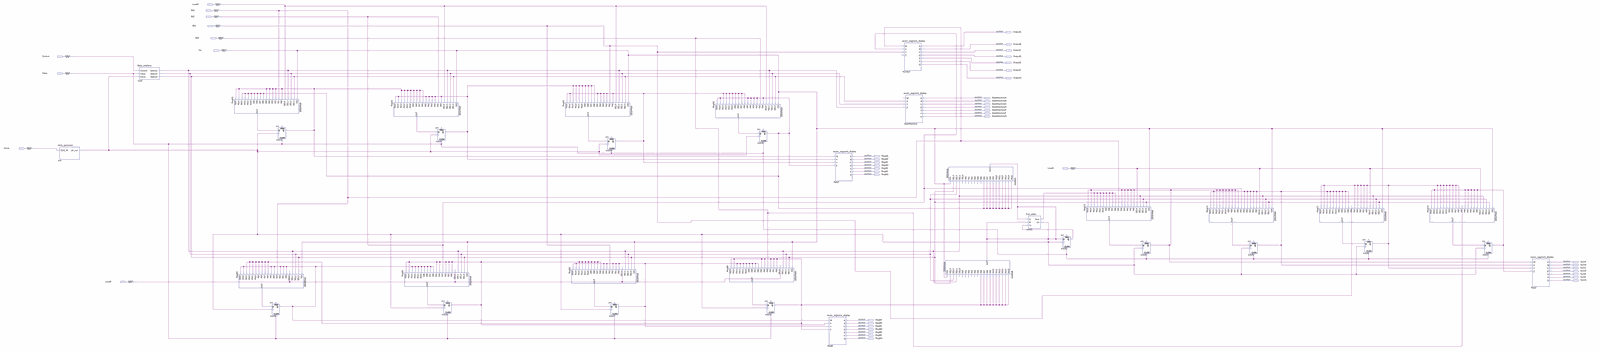
[diagram p0: schematic sheet, whole]
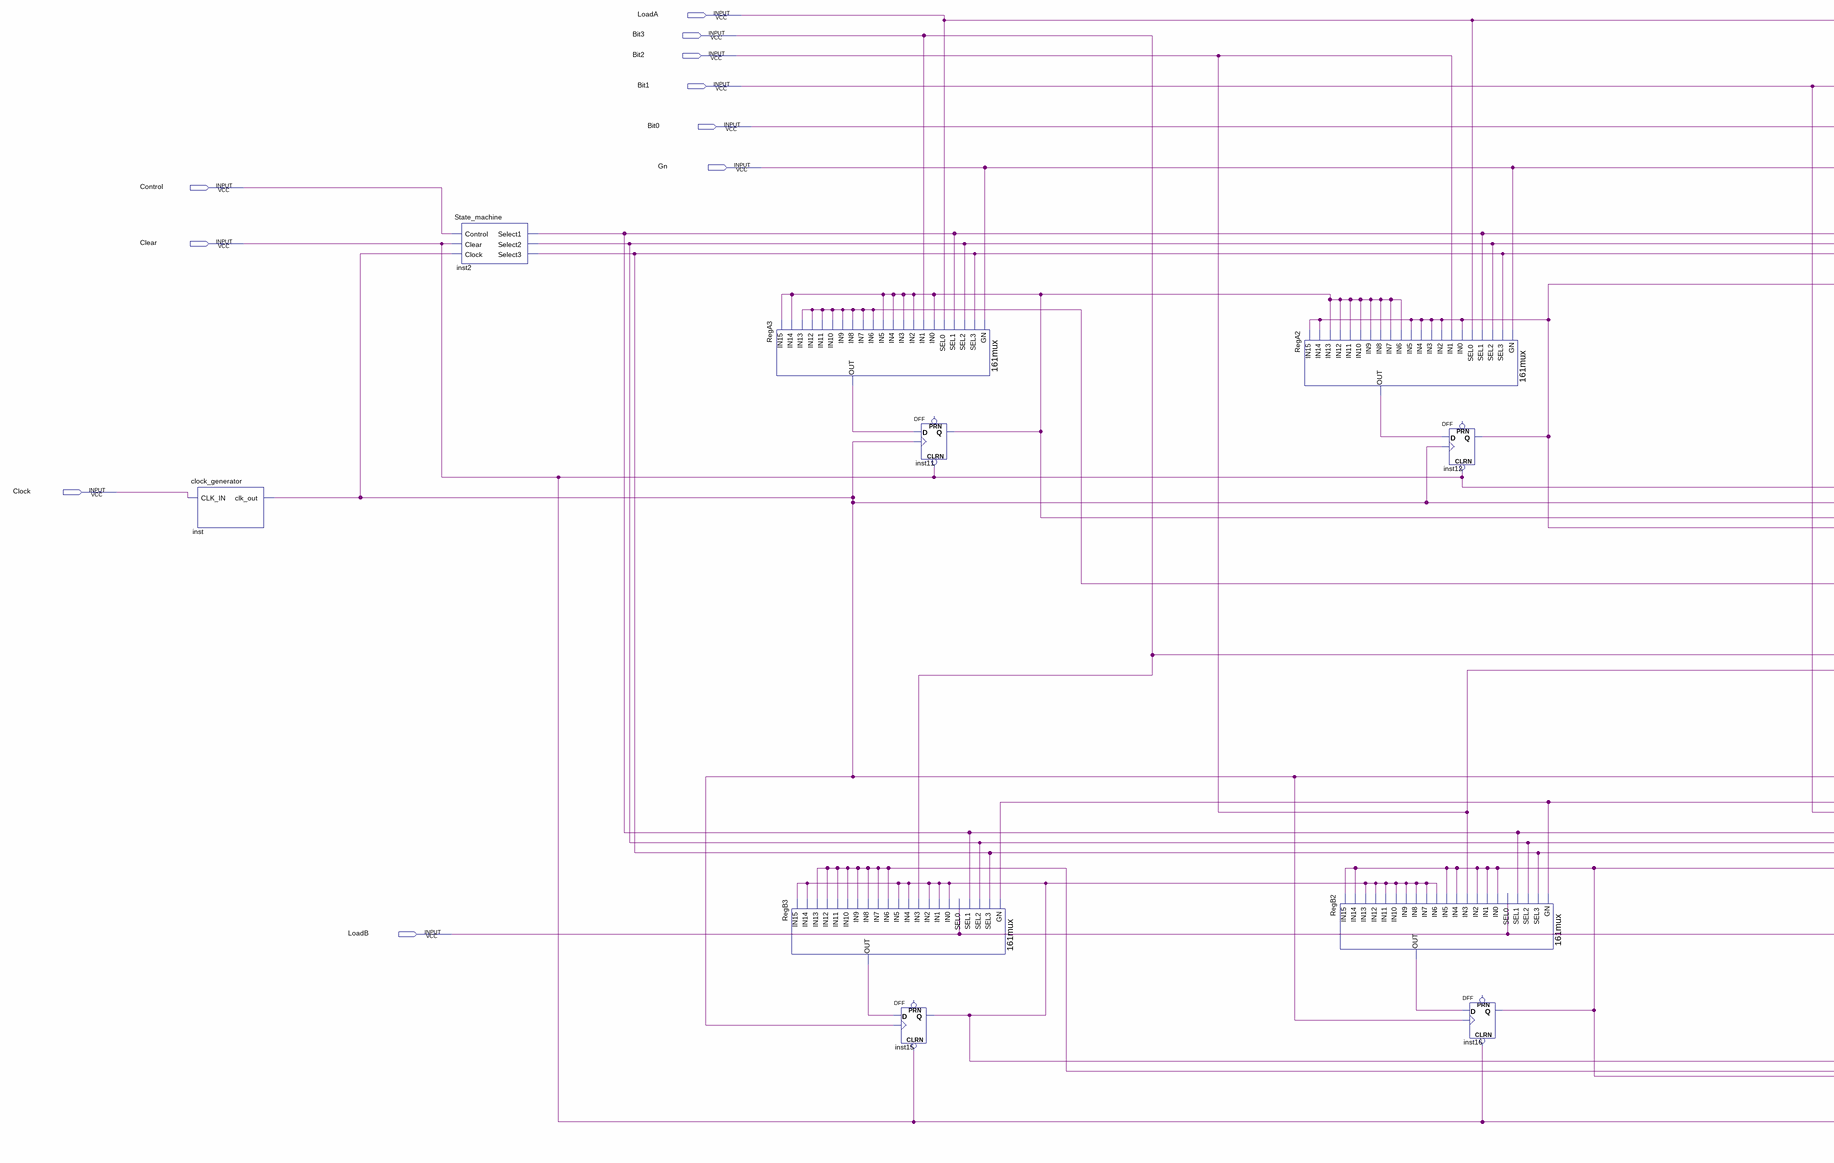
[diagram p1: schematic sheet, left part]
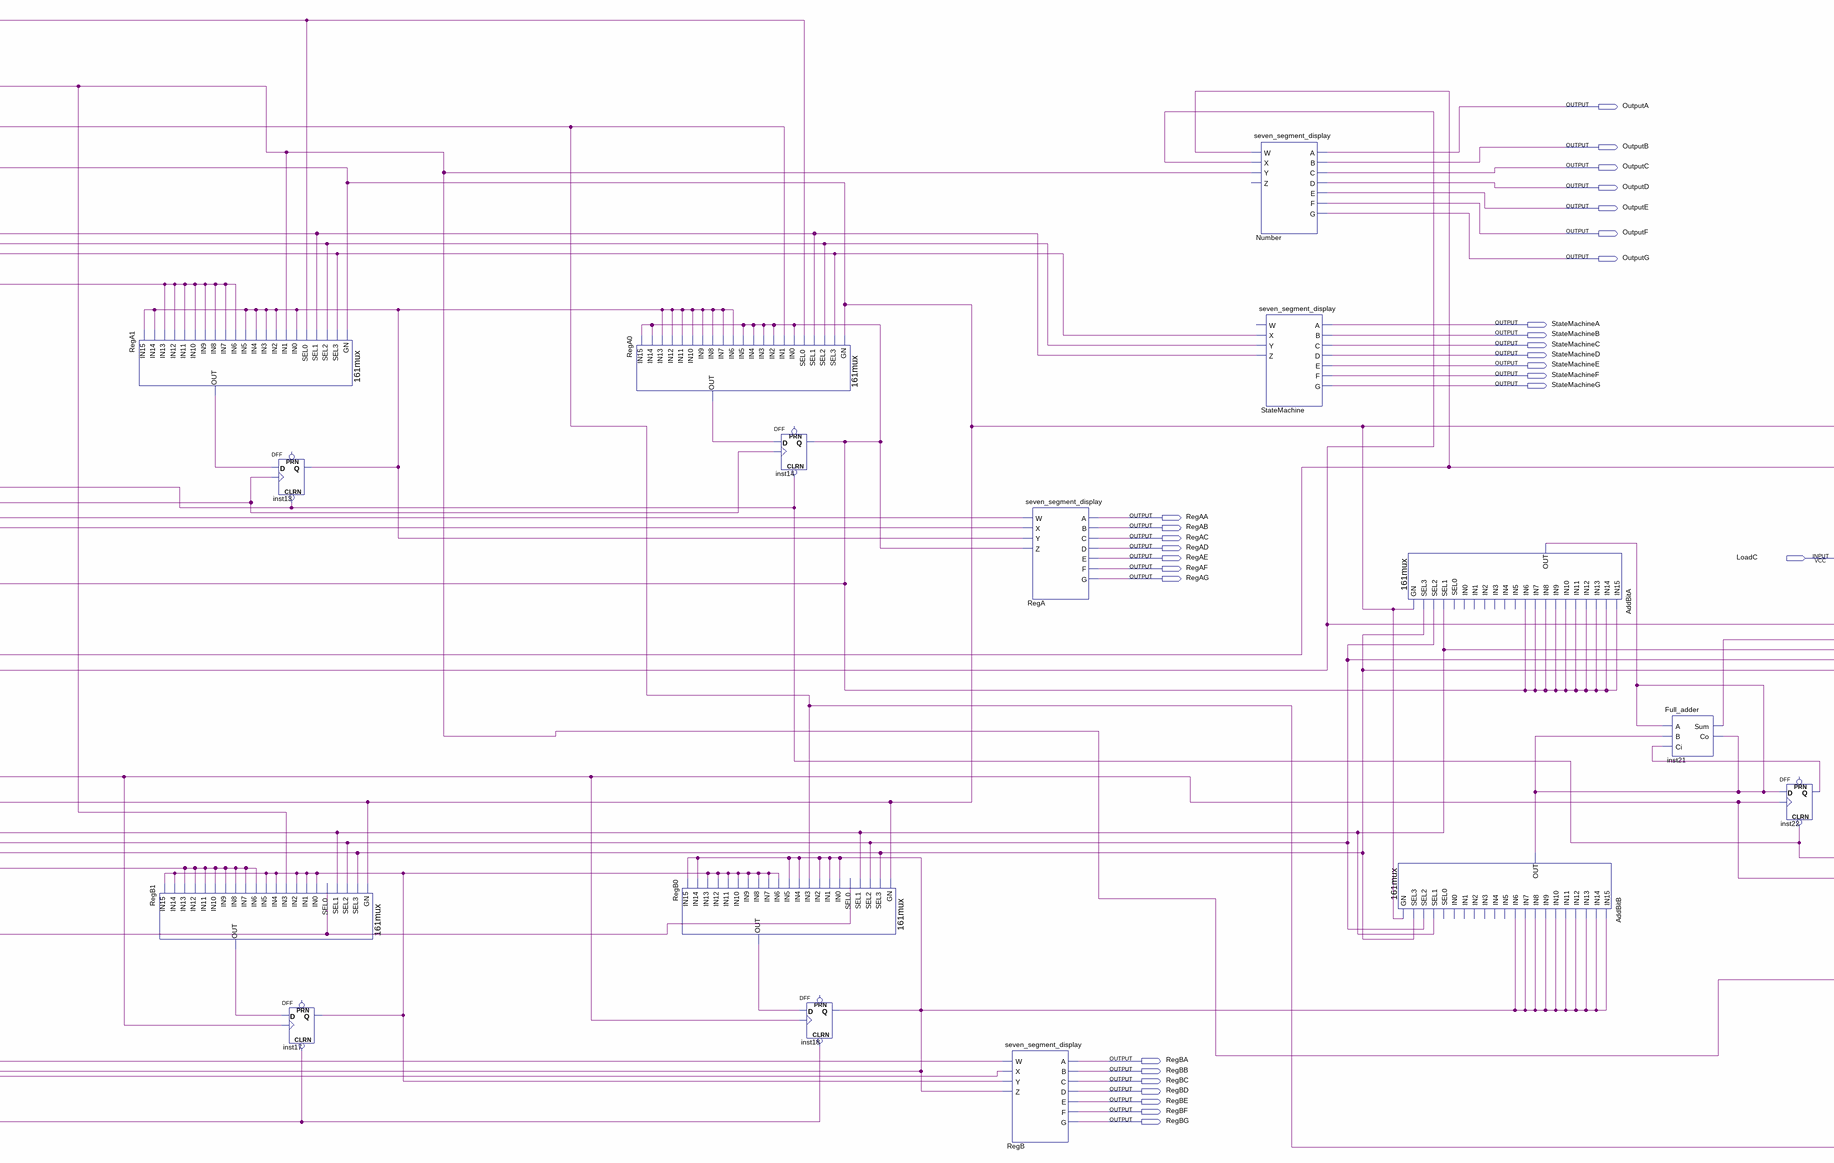
[diagram p2: schematic sheet, centre part]
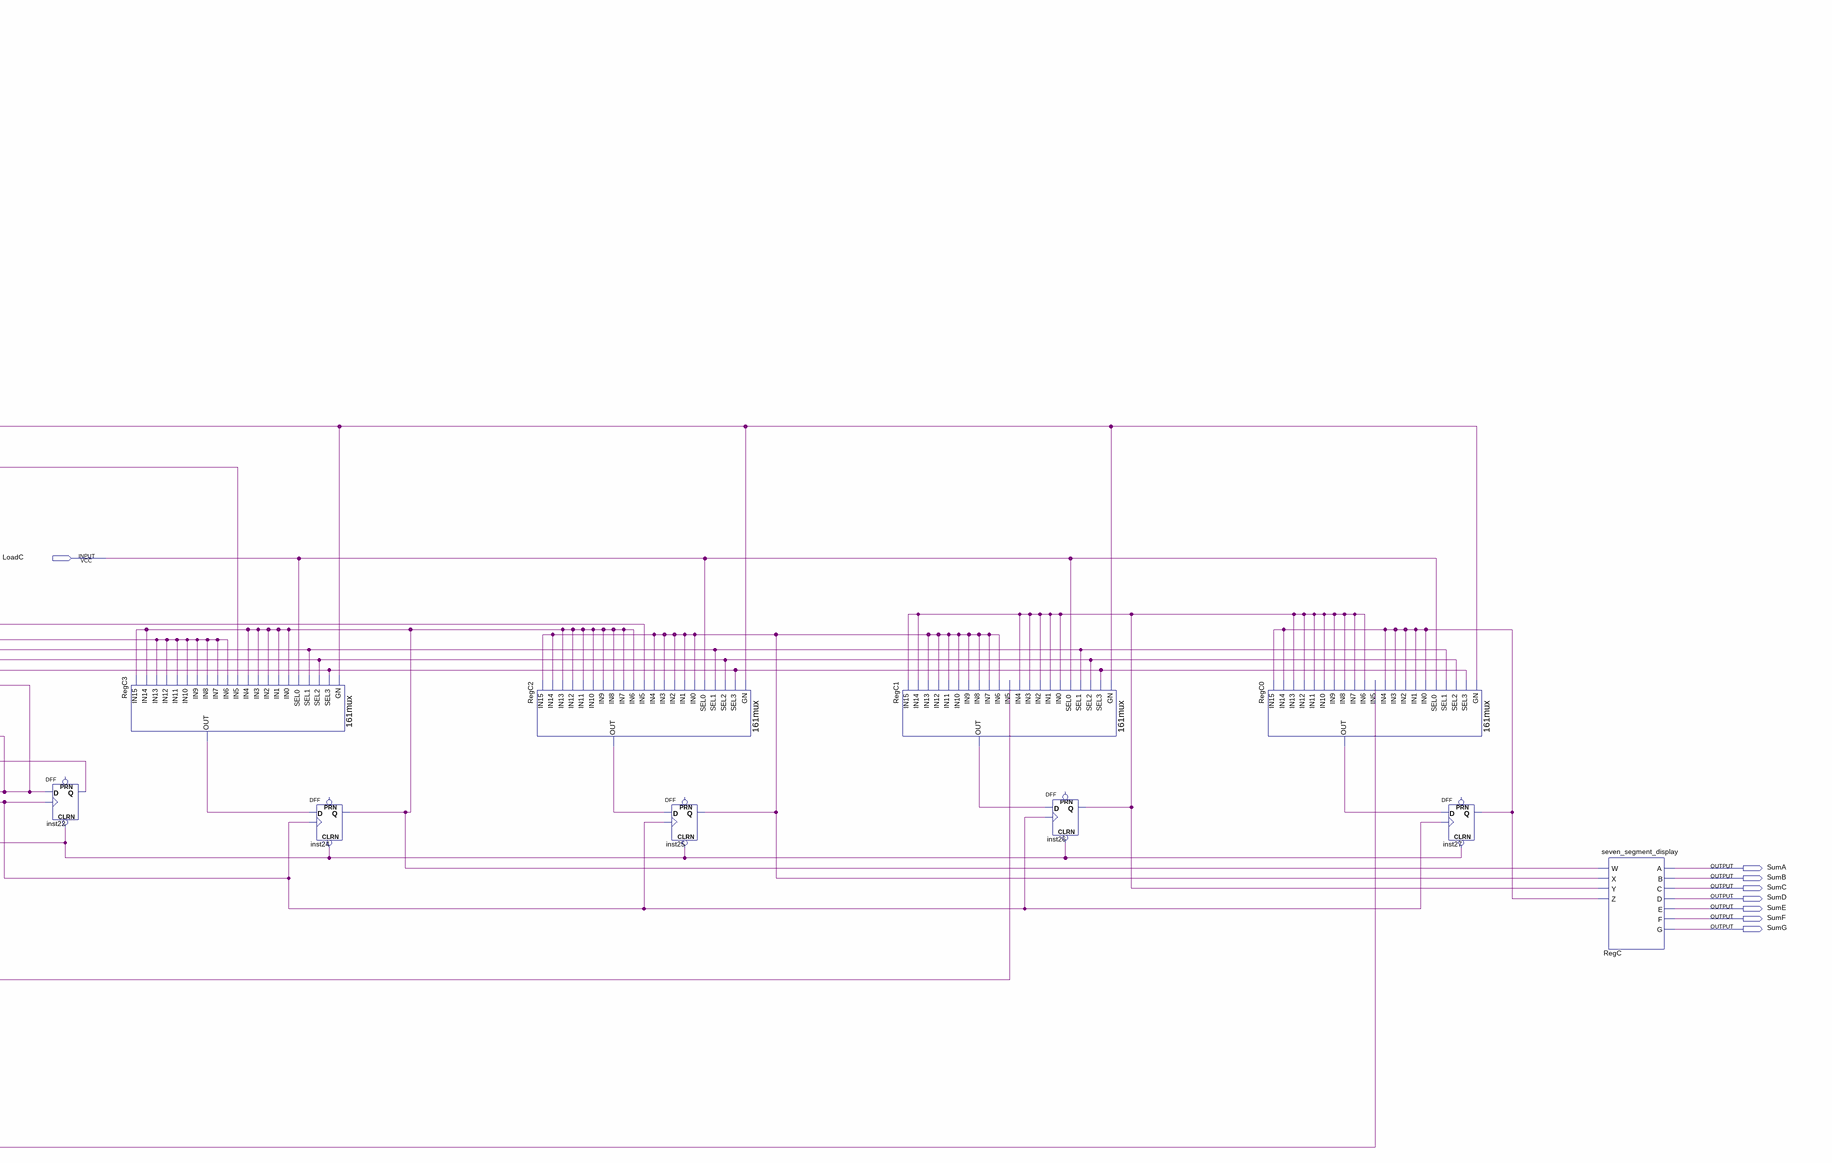
[diagram p3: schematic sheet, right part]
// Quartus schematic 4BitAdder.bdf as structural Verilog: 35 symbols, 46 pins
module \4BitAdder  (
  input  LoadA,
  input  Bit3,
  input  Bit2,
  input  Bit1,
  input  Bit0,
  input  Gn,
  input  Control,
  input  Clear,
  input  Clock,
  input  LoadC,
  input  LoadB,
  output OutputA,
  output OutputB,
  output OutputC,
  output OutputD,
  output OutputE,
  output OutputF,
  output OutputG,
  output StateMachineA,
  output StateMachineB,
  output StateMachineC,
  output StateMachineD,
  output StateMachineE,
  output StateMachineF,
  output StateMachineG,
  output RegAA,
  output RegAB,
  output RegAC,
  output RegAD,
  output RegAE,
  output RegAF,
  output RegAG,
  output SumA,
  output SumB,
  output SumC,
  output SumD,
  output SumE,
  output SumF,
  output SumG,
  output RegBA,
  output RegBB,
  output RegBC,
  output RegBD,
  output RegBE,
  output RegBF,
  output RegBG
);

  wire AddBitA_out, inst2_select1, inst2_select2, inst2_select3, inst11_q, inst12_q, inst13_q, inst14_q,
       inst15_q, inst16_q, inst17_q, inst18_q, inst21_sum, inst22_q, inst24_q, inst25_q, inst26_q, inst27_q,
       inst_clk_out, RegA0_out, RegA1_out, RegA2_out, RegA3_out, RegB0_out, RegB1_out, RegB2_out, RegB3_out,
       RegC0_out, RegC1_out, RegC2_out, RegC3_out;

  clock_generator inst (.CLK_IN(Clock), .clk_out(inst_clk_out));
  State_machine inst2 (
    .Control(Control), .Clear(Clear), .Clock(inst_clk_out), .Select1(inst2_select1), .Select2(inst2_select2),
    .Select3(inst2_select3));
  \161mux  RegA3 (
    .SEL3(inst2_select3), .GN(Gn), .IN0(inst11_q), .SEL0(LoadA), .SEL1(inst2_select1), .SEL2(inst2_select2),
    .IN3(inst11_q), .IN2(inst11_q), .IN1(Bit3), .IN6(inst14_q), .IN5(inst11_q), .IN4(inst11_q),
    .IN9(inst14_q), .IN8(inst14_q), .IN7(inst14_q), .IN11(inst14_q), .IN12(inst14_q), .IN10(inst14_q),
    .IN15(inst11_q), .IN14(inst11_q), .IN13(inst14_q), .OUT(RegA3_out));
  \161mux  RegB3 (
    .SEL3(inst2_select3), .GN(Gn), .IN0(inst15_q), .SEL0(LoadB), .SEL1(inst2_select1), .SEL2(inst2_select2),
    .IN3(Bit3), .IN2(inst15_q), .IN1(inst15_q), .IN6(inst18_q), .IN5(inst15_q), .IN4(inst15_q),
    .IN9(inst18_q), .IN8(inst18_q), .IN7(inst18_q), .IN11(inst18_q), .IN12(inst18_q), .IN10(inst18_q),
    .IN15(inst15_q), .IN14(inst15_q), .IN13(inst18_q), .OUT(RegB3_out));
  DFF inst15 (.CLRN(Clear), .CLK(inst_clk_out), .D(RegB3_out), .Q(inst15_q));  // open: PRN
  DFF inst11 (.CLRN(Clear), .CLK(inst_clk_out), .D(RegA3_out), .Q(inst11_q));  // open: PRN
  \161mux  RegA2 (
    .SEL3(inst2_select3), .GN(Gn), .IN0(inst12_q), .SEL0(LoadA), .SEL1(inst2_select1), .SEL2(inst2_select2),
    .IN3(inst12_q), .IN2(inst12_q), .IN1(Bit2), .IN6(inst11_q), .IN5(inst12_q), .IN4(inst12_q),
    .IN9(inst11_q), .IN8(inst11_q), .IN7(inst11_q), .IN11(inst11_q), .IN12(inst11_q), .IN10(inst11_q),
    .IN15(inst12_q), .IN14(inst12_q), .IN13(inst11_q), .OUT(RegA2_out));
  \161mux  RegB2 (
    .SEL3(inst2_select3), .GN(Gn), .IN0(inst16_q), .SEL0(LoadB), .SEL1(inst2_select1), .SEL2(inst2_select2),
    .IN3(Bit2), .IN2(inst16_q), .IN1(inst16_q), .IN6(inst15_q), .IN5(inst16_q), .IN4(inst16_q),
    .IN9(inst15_q), .IN8(inst15_q), .IN7(inst15_q), .IN11(inst15_q), .IN12(inst15_q), .IN10(inst15_q),
    .IN15(inst16_q), .IN14(inst16_q), .IN13(inst15_q), .OUT(RegB2_out));
  DFF inst12 (.CLRN(Clear), .CLK(inst_clk_out), .D(RegA2_out), .Q(inst12_q));  // open: PRN
  DFF inst16 (.CLRN(Clear), .CLK(inst_clk_out), .D(RegB2_out), .Q(inst16_q));  // open: PRN
  \161mux  RegA1 (
    .SEL3(inst2_select3), .GN(Gn), .IN0(inst13_q), .SEL0(LoadA), .SEL1(inst2_select1), .SEL2(inst2_select2),
    .IN3(inst13_q), .IN2(inst13_q), .IN1(Bit1), .IN6(inst12_q), .IN5(inst13_q), .IN4(inst13_q),
    .IN9(inst12_q), .IN8(inst12_q), .IN7(inst12_q), .IN11(inst12_q), .IN12(inst12_q), .IN10(inst12_q),
    .IN15(inst13_q), .IN14(inst13_q), .IN13(inst12_q), .OUT(RegA1_out));
  \161mux  RegB1 (
    .SEL3(inst2_select3), .GN(Gn), .IN0(inst17_q), .SEL0(LoadB), .SEL1(inst2_select1), .SEL2(inst2_select2),
    .IN3(Bit1), .IN2(inst17_q), .IN1(inst17_q), .IN6(inst16_q), .IN5(inst17_q), .IN4(inst17_q),
    .IN9(inst16_q), .IN8(inst16_q), .IN7(inst16_q), .IN11(inst16_q), .IN12(inst16_q), .IN10(inst16_q),
    .IN15(inst17_q), .IN14(inst17_q), .IN13(inst16_q), .OUT(RegB1_out));
  DFF inst13 (.CLRN(Clear), .CLK(inst_clk_out), .D(RegA1_out), .Q(inst13_q));  // open: PRN
  DFF inst17 (.CLRN(Clear), .CLK(inst_clk_out), .D(RegB1_out), .Q(inst17_q));  // open: PRN
  \161mux  RegA0 (
    .SEL3(inst2_select3), .GN(Gn), .IN0(inst14_q), .SEL0(LoadA), .SEL1(inst2_select1), .SEL2(inst2_select2),
    .IN3(inst14_q), .IN2(inst14_q), .IN1(Bit0), .IN6(inst13_q), .IN5(inst14_q), .IN4(inst14_q),
    .IN9(inst13_q), .IN8(inst13_q), .IN7(inst13_q), .IN11(inst13_q), .IN12(inst13_q), .IN10(inst13_q),
    .IN15(inst14_q), .IN14(inst14_q), .IN13(inst13_q), .OUT(RegA0_out));
  \161mux  RegB0 (
    .SEL3(inst2_select3), .GN(Gn), .IN0(inst18_q), .SEL0(LoadB), .SEL1(inst2_select1), .SEL2(inst2_select2),
    .IN3(Bit0), .IN2(inst18_q), .IN1(inst18_q), .IN6(inst17_q), .IN5(inst18_q), .IN4(inst18_q),
    .IN9(inst17_q), .IN8(inst17_q), .IN7(inst17_q), .IN11(inst17_q), .IN12(inst17_q), .IN10(inst17_q),
    .IN15(inst18_q), .IN14(inst18_q), .IN13(inst17_q), .OUT(RegB0_out));
  DFF inst14 (.CLRN(Clear), .CLK(inst_clk_out), .D(RegA0_out), .Q(inst14_q));  // open: PRN
  DFF inst18 (.CLRN(Clear), .CLK(inst_clk_out), .D(RegB0_out), .Q(inst18_q));  // open: PRN
  seven_segment_display RegA (
    .W(inst11_q), .X(inst12_q), .Y(inst13_q), .Z(inst14_q), .A(RegAA), .B(RegAB), .C(RegAC), .D(RegAD),
    .E(RegAE), .F(RegAF), .G(RegAG));
  seven_segment_display RegB (
    .W(inst15_q), .X(inst16_q), .Y(inst17_q), .Z(inst18_q), .A(RegBA), .B(RegBB), .C(RegBC), .D(RegBD),
    .E(RegBE), .F(RegBF), .G(RegBG));
  seven_segment_display Number (
    .W(Bit3), .X(Bit2), .Y(Bit1), .A(OutputA), .B(OutputB), .C(OutputC), .D(OutputD), .E(OutputE),
    .F(OutputF), .G(OutputG));  // open: Z
  seven_segment_display StateMachine (
    .X(inst2_select3), .Y(inst2_select2), .Z(inst2_select1), .A(StateMachineA), .B(StateMachineB),
    .C(StateMachineC), .D(StateMachineD), .E(StateMachineE), .F(StateMachineF), .G(StateMachineG));  // open: W
  \161mux  AddBitA (
    .SEL3(inst2_select3), .GN(Gn), .SEL1(inst2_select1), .SEL2(inst2_select2), .IN6(inst14_q),
    .IN9(inst14_q), .IN8(inst14_q), .IN7(inst14_q), .IN11(inst14_q), .IN12(inst14_q), .IN10(inst14_q),
    .IN15(inst14_q), .IN14(inst14_q), .IN13(inst14_q), .OUT(AddBitA_out));  // open: IN0, SEL0, IN3, IN2, IN1, IN5, IN4
  \161mux  AddBitB (
    .SEL3(inst2_select3), .GN(Gn), .SEL1(inst2_select1), .SEL2(inst2_select2), .IN6(inst18_q),
    .IN9(inst18_q), .IN8(inst18_q), .IN7(inst18_q), .IN11(inst18_q), .IN12(inst18_q), .IN10(inst18_q),
    .IN15(inst18_q), .IN14(inst18_q), .IN13(inst18_q), .OUT(AddBitA_out));  // open: IN0, SEL0, IN3, IN2, IN1, IN5, IN4
  Full_adder inst21 (.A(AddBitA_out), .B(AddBitA_out), .Ci(inst22_q), .Sum(inst21_sum), .Co(AddBitA_out));
  DFF inst22 (.CLRN(Clear), .CLK(inst_clk_out), .D(AddBitA_out), .Q(inst22_q));  // open: PRN
  \161mux  RegC3 (
    .SEL3(inst2_select3), .GN(Gn), .IN0(inst24_q), .SEL0(LoadC), .SEL1(inst2_select1), .SEL2(inst2_select2),
    .IN3(inst24_q), .IN2(inst24_q), .IN1(inst24_q), .IN6(inst21_sum), .IN5(Bit3), .IN4(inst24_q),
    .IN9(inst21_sum), .IN8(inst21_sum), .IN7(inst21_sum), .IN11(inst21_sum), .IN12(inst21_sum),
    .IN10(inst21_sum), .IN15(inst24_q), .IN14(inst24_q), .IN13(inst21_sum), .OUT(RegC3_out));
  DFF inst24 (.CLRN(Clear), .CLK(inst_clk_out), .D(RegC3_out), .Q(inst24_q));  // open: PRN
  \161mux  RegC2 (
    .SEL3(inst2_select3), .GN(Gn), .IN0(inst25_q), .SEL0(LoadC), .SEL1(inst2_select1), .SEL2(inst2_select2),
    .IN3(inst25_q), .IN2(inst25_q), .IN1(inst25_q), .IN6(inst24_q), .IN5(Bit2), .IN4(inst25_q),
    .IN9(inst24_q), .IN8(inst24_q), .IN7(inst24_q), .IN11(inst24_q), .IN12(inst24_q), .IN10(inst24_q),
    .IN15(inst25_q), .IN14(inst25_q), .IN13(inst24_q), .OUT(RegC2_out));
  DFF inst25 (.CLRN(Clear), .CLK(inst_clk_out), .D(RegC2_out), .Q(inst25_q));  // open: PRN
  \161mux  RegC1 (
    .SEL3(inst2_select3), .GN(Gn), .IN0(inst26_q), .SEL0(LoadC), .SEL1(inst2_select1), .SEL2(inst2_select2),
    .IN3(inst26_q), .IN2(inst26_q), .IN1(inst26_q), .IN6(inst25_q), .IN5(Bit1), .IN4(inst26_q),
    .IN9(inst25_q), .IN8(inst25_q), .IN7(inst25_q), .IN11(inst25_q), .IN12(inst25_q), .IN10(inst25_q),
    .IN15(inst26_q), .IN14(inst26_q), .IN13(inst25_q), .OUT(RegC1_out));
  DFF inst26 (.CLRN(Clear), .CLK(inst_clk_out), .D(RegC1_out), .Q(inst26_q));  // open: PRN
  \161mux  RegC0 (
    .SEL3(inst2_select3), .GN(Gn), .IN0(inst27_q), .SEL0(LoadC), .SEL1(inst2_select1), .SEL2(inst2_select2),
    .IN3(inst27_q), .IN2(inst27_q), .IN1(inst27_q), .IN6(inst26_q), .IN5(Bit0), .IN4(inst27_q),
    .IN9(inst26_q), .IN8(inst26_q), .IN7(inst26_q), .IN11(inst26_q), .IN12(inst26_q), .IN10(inst26_q),
    .IN15(inst27_q), .IN14(inst27_q), .IN13(inst26_q), .OUT(RegC0_out));
  DFF inst27 (.CLRN(Clear), .CLK(inst_clk_out), .D(RegC0_out), .Q(inst27_q));  // open: PRN
  seven_segment_display RegC (
    .W(inst24_q), .X(inst25_q), .Y(inst26_q), .Z(inst27_q), .A(SumA), .B(SumB), .C(SumC), .D(SumD), .E(SumE),
    .F(SumF), .G(SumG));
endmodule
